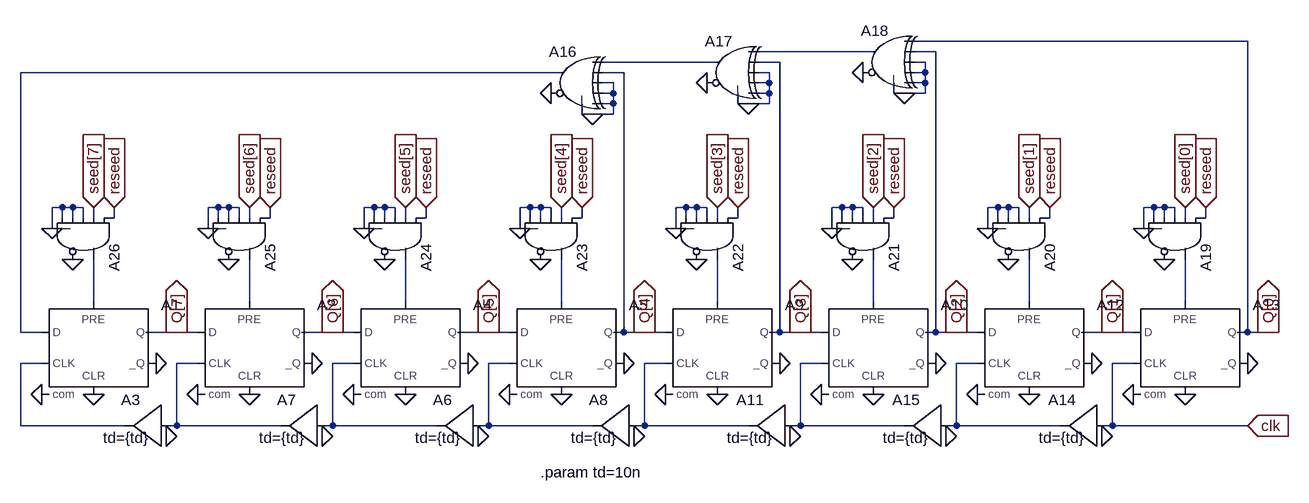
[diagram p0: schematic lfsr_8bit.asc]
lfsr_8bit.asc, the LTspice schematic file:
Version 4
SHEET 1 2204 680
WIRE 1920 -352 1408 -352
WIRE 1344 -336 1168 -336
WIRE 1440 -336 1408 -336
WIRE 1104 -320 928 -320
WIRE 1200 -320 1168 -320
WIRE 1424 -320 1408 -320
WIRE 864 -304 32 -304
WIRE 960 -304 928 -304
WIRE 1184 -304 1168 -304
WIRE 1424 -304 1424 -320
WIRE 1424 -304 1408 -304
WIRE 944 -288 928 -288
WIRE 1184 -288 1184 -304
WIRE 1184 -288 1168 -288
WIRE 1424 -288 1424 -304
WIRE 1424 -288 1408 -288
WIRE 944 -272 944 -288
WIRE 944 -272 928 -272
WIRE 1184 -272 1184 -288
WIRE 1184 -272 1168 -272
WIRE 1376 -272 1376 -288
WIRE 1392 -272 1376 -272
WIRE 1424 -272 1424 -288
WIRE 1424 -272 1392 -272
WIRE 944 -256 944 -272
WIRE 944 -256 928 -256
WIRE 1136 -256 1136 -272
WIRE 1152 -256 1136 -256
WIRE 1184 -256 1184 -272
WIRE 1184 -256 1152 -256
WIRE 896 -240 896 -256
WIRE 912 -240 896 -240
WIRE 944 -240 944 -256
WIRE 944 -240 912 -240
WIRE 96 -96 80 -96
WIRE 112 -96 96 -96
WIRE 128 -96 112 -96
WIRE 336 -96 320 -96
WIRE 352 -96 336 -96
WIRE 368 -96 352 -96
WIRE 576 -96 560 -96
WIRE 592 -96 576 -96
WIRE 608 -96 592 -96
WIRE 816 -96 800 -96
WIRE 832 -96 816 -96
WIRE 848 -96 832 -96
WIRE 1056 -96 1040 -96
WIRE 1072 -96 1056 -96
WIRE 1088 -96 1072 -96
WIRE 1296 -96 1280 -96
WIRE 1312 -96 1296 -96
WIRE 1328 -96 1312 -96
WIRE 1536 -96 1520 -96
WIRE 1552 -96 1536 -96
WIRE 1568 -96 1552 -96
WIRE 1776 -96 1760 -96
WIRE 1792 -96 1776 -96
WIRE 1808 -96 1792 -96
WIRE 96 -80 96 -96
WIRE 112 -80 112 -96
WIRE 128 -80 128 -96
WIRE 144 -80 144 -96
WIRE 176 -80 176 -96
WIRE 176 -80 160 -80
WIRE 336 -80 336 -96
WIRE 352 -80 352 -96
WIRE 368 -80 368 -96
WIRE 384 -80 384 -96
WIRE 416 -80 416 -96
WIRE 416 -80 400 -80
WIRE 576 -80 576 -96
WIRE 592 -80 592 -96
WIRE 608 -80 608 -96
WIRE 624 -80 624 -96
WIRE 656 -80 656 -96
WIRE 656 -80 640 -80
WIRE 816 -80 816 -96
WIRE 832 -80 832 -96
WIRE 848 -80 848 -96
WIRE 864 -80 864 -96
WIRE 896 -80 896 -96
WIRE 896 -80 880 -80
WIRE 1056 -80 1056 -96
WIRE 1072 -80 1072 -96
WIRE 1088 -80 1088 -96
WIRE 1104 -80 1104 -96
WIRE 1136 -80 1136 -96
WIRE 1136 -80 1120 -80
WIRE 1296 -80 1296 -96
WIRE 1312 -80 1312 -96
WIRE 1328 -80 1328 -96
WIRE 1344 -80 1344 -96
WIRE 1376 -80 1376 -96
WIRE 1376 -80 1360 -80
WIRE 1536 -80 1536 -96
WIRE 1552 -80 1552 -96
WIRE 1568 -80 1568 -96
WIRE 1584 -80 1584 -96
WIRE 1616 -80 1616 -96
WIRE 1616 -80 1600 -80
WIRE 1776 -80 1776 -96
WIRE 1792 -80 1792 -96
WIRE 1808 -80 1808 -96
WIRE 1824 -80 1824 -96
WIRE 1856 -80 1856 -96
WIRE 1856 -80 1840 -80
WIRE 80 -64 80 -96
WIRE 96 -64 80 -64
WIRE 320 -64 320 -96
WIRE 336 -64 320 -64
WIRE 560 -64 560 -96
WIRE 576 -64 560 -64
WIRE 800 -64 800 -96
WIRE 816 -64 800 -64
WIRE 1040 -64 1040 -96
WIRE 1056 -64 1040 -64
WIRE 1280 -64 1280 -96
WIRE 1296 -64 1280 -64
WIRE 1520 -64 1520 -96
WIRE 1536 -64 1520 -64
WIRE 1760 -64 1760 -96
WIRE 1776 -64 1760 -64
WIRE 144 48 144 -16
WIRE 384 48 384 -16
WIRE 624 48 624 -16
WIRE 864 48 864 -16
WIRE 1104 48 1104 -16
WIRE 1344 48 1344 -16
WIRE 1584 48 1584 -16
WIRE 1824 48 1824 -16
WIRE 32 96 32 -304
WIRE 64 96 32 96
WIRE 272 96 224 96
WIRE 304 96 272 96
WIRE 512 96 464 96
WIRE 544 96 512 96
WIRE 752 96 704 96
WIRE 784 96 752 96
WIRE 960 96 960 -304
WIRE 960 96 944 96
WIRE 992 96 960 96
WIRE 1024 96 992 96
WIRE 1200 96 1200 -320
WIRE 1200 96 1184 96
WIRE 1232 96 1200 96
WIRE 1264 96 1232 96
WIRE 1440 96 1440 -336
WIRE 1440 96 1424 96
WIRE 1472 96 1440 96
WIRE 1504 96 1472 96
WIRE 1712 96 1664 96
WIRE 1744 96 1712 96
WIRE 1920 96 1920 -352
WIRE 1920 96 1904 96
WIRE 1952 96 1920 96
WIRE 1968 96 1952 96
WIRE 64 144 32 144
WIRE 304 144 272 144
WIRE 544 144 512 144
WIRE 784 144 752 144
WIRE 1024 144 992 144
WIRE 1264 144 1232 144
WIRE 1504 144 1472 144
WIRE 1744 144 1712 144
WIRE 32 240 32 144
WIRE 192 240 32 240
WIRE 272 240 272 144
WIRE 272 240 256 240
WIRE 432 240 272 240
WIRE 512 240 512 144
WIRE 512 240 496 240
WIRE 672 240 512 240
WIRE 752 240 752 144
WIRE 752 240 736 240
WIRE 912 240 752 240
WIRE 992 240 992 144
WIRE 992 240 976 240
WIRE 1152 240 992 240
WIRE 1232 240 1232 144
WIRE 1232 240 1216 240
WIRE 1392 240 1232 240
WIRE 1472 240 1472 144
WIRE 1472 240 1456 240
WIRE 1632 240 1472 240
WIRE 1712 240 1712 144
WIRE 1712 240 1696 240
WIRE 1920 240 1712 240
FLAG 240 144 0
FLAG 480 144 0
FLAG 304 192 0
FLAG 64 192 0
FLAG 144 192 0
FLAG 384 192 0
FLAG 256 256 0
FLAG 272 96 Q[7]
IOPIN 272 96 Out
FLAG 720 144 0
FLAG 960 144 0
FLAG 784 192 0
FLAG 544 192 0
FLAG 624 192 0
FLAG 864 192 0
FLAG 736 256 0
FLAG 752 96 Q[5]
IOPIN 752 96 Out
FLAG 496 256 0
FLAG 976 256 0
FLAG 512 96 Q[6]
IOPIN 512 96 Out
FLAG 1200 144 0
FLAG 1440 144 0
FLAG 1264 192 0
FLAG 1024 192 0
FLAG 1104 192 0
FLAG 1344 192 0
FLAG 1216 256 0
FLAG 1232 96 Q[3]
IOPIN 1232 96 Out
FLAG 1680 144 0
FLAG 1744 192 0
FLAG 1504 192 0
FLAG 1584 192 0
FLAG 1824 192 0
FLAG 1696 256 0
FLAG 1712 96 Q[1]
IOPIN 1712 96 Out
FLAG 1456 256 0
FLAG 1472 96 Q[2]
IOPIN 1472 96 Out
FLAG 992 96 Q[4]
IOPIN 992 96 Out
FLAG 1920 144 0
FLAG 1952 96 Q[0]
IOPIN 1952 96 Out
FLAG 1920 240 clk
IOPIN 1920 240 In
FLAG 912 -240 0
FLAG 848 -272 0
FLAG 1152 -256 0
FLAG 1088 -288 0
FLAG 1392 -272 0
FLAG 1328 -304 0
FLAG 1824 -96 seed[0]
IOPIN 1824 -96 In
FLAG 1584 -96 seed[1]
IOPIN 1584 -96 In
FLAG 1344 -96 seed[2]
IOPIN 1344 -96 In
FLAG 1104 -96 seed[3]
IOPIN 1104 -96 In
FLAG 864 -96 seed[4]
IOPIN 864 -96 In
FLAG 624 -96 seed[5]
IOPIN 624 -96 In
FLAG 384 -96 seed[6]
IOPIN 384 -96 In
FLAG 144 -96 seed[7]
IOPIN 144 -96 In
FLAG 1792 -16 0
FLAG 1760 -64 0
FLAG 1856 -96 reseed
IOPIN 1856 -96 In
FLAG 1552 -16 0
FLAG 1520 -64 0
FLAG 1616 -96 reseed
IOPIN 1616 -96 In
FLAG 1312 -16 0
FLAG 1280 -64 0
FLAG 1376 -96 reseed
IOPIN 1376 -96 In
FLAG 1072 -16 0
FLAG 1040 -64 0
FLAG 1136 -96 reseed
IOPIN 1136 -96 In
FLAG 832 -16 0
FLAG 800 -64 0
FLAG 896 -96 reseed
IOPIN 896 -96 In
FLAG 592 -16 0
FLAG 560 -64 0
FLAG 656 -96 reseed
IOPIN 656 -96 In
FLAG 352 -16 0
FLAG 320 -64 0
FLAG 416 -96 reseed
IOPIN 416 -96 In
FLAG 112 -16 0
FLAG 80 -64 0
FLAG 176 -96 reseed
IOPIN 176 -96 In
SYMBOL Digital\\dflop 144 48 R0
SYMATTR InstName A1
SYMBOL Digital\\dflop 384 48 R0
SYMATTR InstName A2
SYMBOL Digital\\buf1 256 176 M0
WINDOW 3 26 83 Left 2
SYMATTR Value td={td}
SYMATTR InstName A3
SYMBOL Digital\\dflop 624 48 R0
SYMATTR InstName A4
SYMBOL Digital\\dflop 864 48 R0
SYMATTR InstName A5
SYMBOL Digital\\buf1 736 176 M0
WINDOW 3 26 83 Left 2
SYMATTR Value td={td}
SYMATTR InstName A6
SYMBOL Digital\\buf1 496 176 M0
WINDOW 3 26 83 Left 2
SYMATTR Value td={td}
SYMATTR InstName A7
SYMBOL Digital\\buf1 976 176 M0
WINDOW 3 26 83 Left 2
SYMATTR Value td={td}
SYMATTR InstName A8
SYMBOL Digital\\dflop 1104 48 R0
SYMATTR InstName A9
SYMBOL Digital\\dflop 1344 48 R0
SYMATTR InstName A10
SYMBOL Digital\\buf1 1216 176 M0
WINDOW 3 26 83 Left 2
SYMATTR Value td={td}
SYMATTR InstName A11
SYMBOL Digital\\dflop 1584 48 R0
SYMATTR InstName A12
SYMBOL Digital\\dflop 1824 48 R0
SYMATTR InstName A13
SYMBOL Digital\\buf1 1696 176 M0
WINDOW 3 26 83 Left 2
SYMATTR Value td={td}
SYMATTR InstName A14
SYMBOL Digital\\buf1 1456 176 M0
WINDOW 3 26 83 Left 2
SYMATTR Value td={td}
SYMATTR InstName A15
SYMBOL Digital\\xor 880 -352 M0
SYMATTR InstName A16
SYMBOL Digital\\xor 1120 -368 M0
SYMATTR InstName A17
SYMBOL Digital\\xor 1360 -384 M0
SYMATTR InstName A18
SYMBOL Digital\\and 1872 -48 R90
SYMATTR InstName A19
SYMBOL Digital\\and 1632 -48 R90
SYMATTR InstName A20
SYMBOL Digital\\and 1392 -48 R90
SYMATTR InstName A21
SYMBOL Digital\\and 1152 -48 R90
SYMATTR InstName A22
SYMBOL Digital\\and 912 -48 R90
SYMATTR InstName A23
SYMBOL Digital\\and 672 -48 R90
SYMATTR InstName A24
SYMBOL Digital\\and 432 -48 R90
SYMATTR InstName A25
SYMBOL Digital\\and 192 -48 R90
SYMATTR InstName A26
TEXT 832 312 Left 2 !.param td=10n

The netlist it stands for:
* lfsr_8bit.asc
A1 N003 0 N012 N004 0 0 Q[7] 0 DFLOP
A2 Q[7] 0 N013 N005 0 0 Q[6] 0 DFLOP
A3 N013 0 0 0 0 0 N012 0 BUF td={td}
A4 Q[6] 0 N014 N006 0 0 Q[5] 0 DFLOP
A5 Q[5] 0 N015 N007 0 0 Q[4] 0 DFLOP
A6 N015 0 0 0 0 0 N014 0 BUF td={td}
A7 N014 0 0 0 0 0 N013 0 BUF td={td}
A8 N016 0 0 0 0 0 N015 0 BUF td={td}
A9 Q[4] 0 N016 N008 0 0 Q[3] 0 DFLOP
A10 Q[3] 0 N017 N009 0 0 Q[2] 0 DFLOP
A11 N017 0 0 0 0 0 N016 0 BUF td={td}
A12 Q[2] 0 N018 N010 0 0 Q[1] 0 DFLOP
A13 Q[1] 0 clk N011 0 0 Q[0] 0 DFLOP
A14 clk 0 0 0 0 0 N018 0 BUF td={td}
A15 N018 0 0 0 0 0 N017 0 BUF td={td}
A16 N002 Q[4] 0 0 0 0 N003 0 XOR
A17 N001 Q[3] 0 0 0 0 N002 0 XOR
A18 Q[0] Q[2] 0 0 0 0 N001 0 XOR
A19 reseed seed[0] 0 0 0 0 N011 0 AND
A20 reseed seed[1] 0 0 0 0 N010 0 AND
A21 reseed seed[2] 0 0 0 0 N009 0 AND
A22 reseed seed[3] 0 0 0 0 N008 0 AND
A23 reseed seed[4] 0 0 0 0 N007 0 AND
A24 reseed seed[5] 0 0 0 0 N006 0 AND
A25 reseed seed[6] 0 0 0 0 N005 0 AND
A26 reseed seed[7] 0 0 0 0 N004 0 AND
.param td=10n
.backanno
.end